# EAGLE design controlsu (EAGLE 5.12)
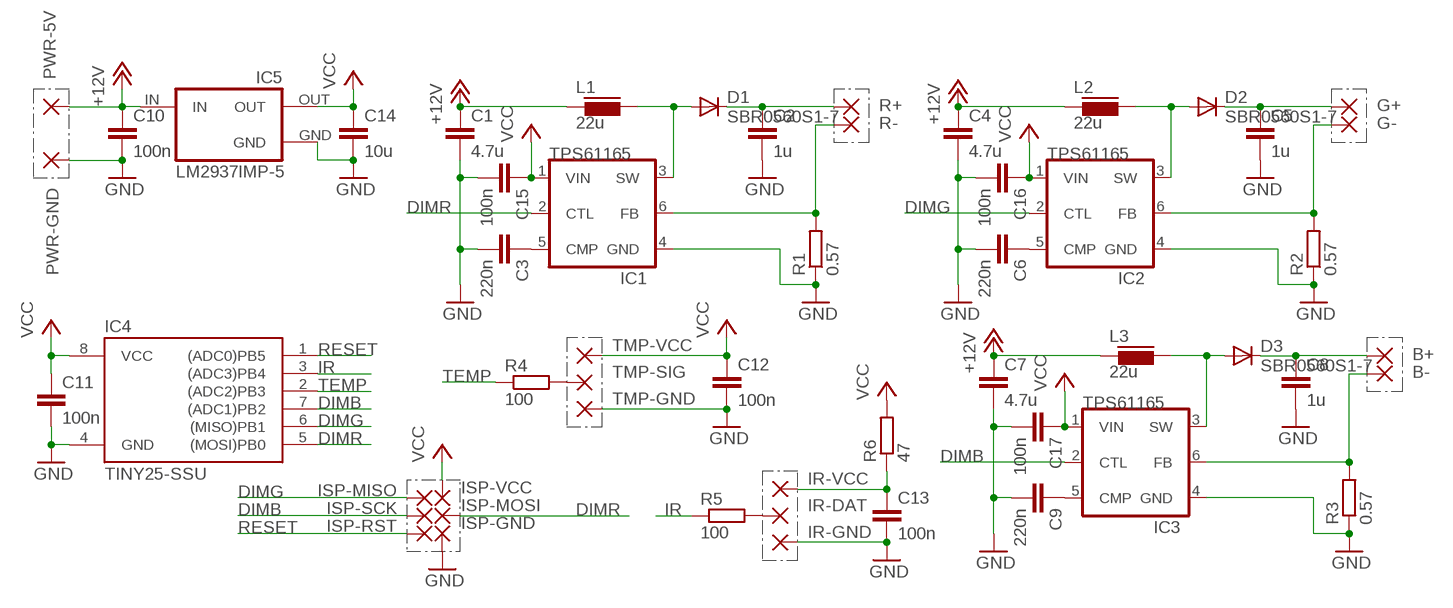
[diagram p0: schematic, sheet 1]

## Parts
B+  WIREPADSMD1,27-254  [SMD1,27-2,54]
B-  WIREPADSMD1,27-254  [SMD1,27-2,54]
C1  4.7u  C-EUC2012  [C2012]
C2  1u  C-EUC2012  [C2012]
C3  220n  C-EUC2012  [C2012]
C4  4.7u  C-EUC2012  [C2012]
C5  1u  C-EUC2012  [C2012]
C6  220n  C-EUC2012  [C2012]
C7  4.7u  C-EUC2012  [C2012]
C8  1u  C-EUC2012  [C2012]
C9  220n  C-EUC2012  [C2012]
C10  100n  C-EUC2012  [C2012]
C11  100n  C-EUC2012  [C2012]
C12  100n  C-EUC2012  [C2012]
C13  100n  C-EUC2012  [C2012]
C14  10u  C-EUC2012  [C2012]
C15  100n  C-EUC2012  [C2012]
C16  100n  C-EUC2012  [C2012]
C17  100n  C-EUC2012  [C2012]
D1  SBR0560S1-7  DIODE-SOD123  [SOD123]
D2  SBR0560S1-7  DIODE-SOD123  [SOD123]
D3  SBR0560S1-7  DIODE-SOD123  [SOD123]
G+  WIREPADSMD1,27-254  [SMD1,27-2,54]
G-  WIREPADSMD1,27-254  [SMD1,27-2,54]
IC1  TPS61165  [SOT23-6]
IC2  TPS61165  [SOT23-6]
IC3  TPS61165  [SOT23-6]
IC4  TINY25-SSU  TINY2/4/85/V-SU  [SOIC8]
IC5  LM2937IMP-5  LM2937IMP-3.3  [SOT223]
IR-DAT  WIREPADSMD1,27-254  [SMD1,27-2,54]
IR-GND  WIREPADSMD1,27-254  [SMD1,27-2,54]
IR-VCC  WIREPADSMD1,27-254  [SMD1,27-2,54]
ISP-GND  WIREPADSMD1,27-254  [SMD1,27-2,54]
ISP-MISO  WIREPADSMD1,27-254  [SMD1,27-2,54]
ISP-MOSI  WIREPADSMD1,27-254  [SMD1,27-2,54]
ISP-RST  WIREPADSMD1,27-254  [SMD1,27-2,54]
ISP-SCK  WIREPADSMD1,27-254  [SMD1,27-2,54]
ISP-VCC  WIREPADSMD1,27-254  [SMD1,27-2,54]
L1  22u  NR-SERIESNR(S)60  [NR60]
L2  22u  NR-SERIESNR(S)60  [NR60]
L3  22u  NR-SERIESNR(S)60  [NR60]
PWR-5V  WIREPADSMD1,27-254  [SMD1,27-2,54]
PWR-GND  WIREPADSMD1,27-254  [SMD1,27-2,54]
R1  0.57  R-EU_M2012  [M2012]
R2  0.57  R-EU_M2012  [M2012]
R3  0.57  R-EU_M2012  [M2012]
R4  100  R-EU_M2012  [M2012]
R5  100  R-EU_M2012  [M2012]
R6  47  R-EU_M2012  [M2012]
R+  WIREPADSMD1,27-254  [SMD1,27-2,54]
R-  WIREPADSMD1,27-254  [SMD1,27-2,54]
TMP-GND  WIREPADSMD1,27-254  [SMD1,27-2,54]
TMP-SIG  WIREPADSMD1,27-254  [SMD1,27-2,54]
TMP-VCC  WIREPADSMD1,27-254  [SMD1,27-2,54]

## Nets
+12V: C1.1 C4.1 C7.1 C10.1 IC5.IN L1.P$1 L2.P$1 L3.P$1 PWR-5V.1(P)
DIMB: IC3.2(CTL) IC4.7((ADC1)PB2) ISP-SCK.1(P)
DIMG: IC2.2(CTL) IC4.6((MISO)PB1) ISP-MISO.1(P)
DIMR: IC1.2(CTL) IC4.5((MOSI)PB0) ISP-MOSI.1(P)
GND: C1.2 C2.2 C3.2 C4.2 C5.2 C6.2 C7.2 C8.2 C9.2 C10.2 C11.2 C12.2 C13.2 C14.2 C15.2 C16.2 C17.2 IC1.4(GND) IC2.4(GND) IC3.4(GND) IC4.4(GND) IC5.GND IR-GND.1(P) ISP-GND.1(P) PWR-GND.1(P) R1.1 R2.1 R3.1 TMP-GND.1(P)
IR: IC4.3((ADC3)PB4) R5.1
L1: D1.A IC1.3(SW) L1.P$2
L2: D2.A IC2.3(SW) L2.P$2
L3: D3.A IC3.3(SW) L3.P$2
N$1: C5.1 D2.C G+.1(P)
N$2: C6.1 IC2.5(CMP)
N$3: G-.1(P) IC2.6(FB) R2.2
N$4: R4.2 TMP-SIG.1(P)
N$5: B+.1(P) C8.1 D3.C
N$6: C2.1 D1.C R+.1(P)
N$7: IR-DAT.1(P) R5.2
N$8: C9.1 IC3.5(CMP)
N$9: C3.1 IC1.5(CMP)
N$10: IC1.6(FB) R1.2 R-.1(P)
N$11: B-.1(P) IC3.6(FB) R3.2
N$12: C13.1 IR-VCC.1(P) R6.1
RESET: IC4.1((ADC0)PB5) ISP-RST.1(P)
TEMP: IC4.2((ADC2)PB3) R4.1
VCC: C11.1 C12.1 C14.1 C15.1 C16.1 C17.1 IC1.1(VIN) IC2.1(VIN) IC3.1(VIN) IC4.8(VCC) IC5.OUT ISP-VCC.1(P) R6.2 TMP-VCC.1(P)

## Power pins joined to a net without a drawn wire
GND: IC5.GND@(GND)

## Library data of the parts
B+ B- G+ G- IR-DAT IR-GND IR-VCC ISP-GND ISP-MISO ISP-MOSI ISP-RST ISP-SCK ISP-VCC PWR-5V PWR-GND R+ R- TMP-GND TMP-SIG TMP-VCC = wirepad:WIREPAD: Wire PAD connect wire on PCB
C1-C17 = rcl:C-EU: CAPACITOR, European symbol
D1-D3 = diode:DIODE-: DIODE
IC1-IC3 = vreg-switch:TPS61165: High Brightness White LED Driver in 2mm x 2mm QFN and SOT-23 Packages FEATURES 3-V to 18-V Input Voltage Range 38-V Open LED Protection 200-mV Reference Voltage With 2% Accuracy 1.2-A Switch FET With 1.2-MHz Switching Frequency Flexible 1 Wire Digital and PWM Brightness Control Built-in Soft Start Up to 90% Efficiency 2mm × 2mm × 0.8mm 6-pin QFN Package With Thermal Pad, and SOT-23 Package APPLICATIONS High Brightness LED Lighting White LED Backlighting for Media Form Factor Display
IC4 = avr-1:TINY2/4/85/V: 8-bit AVR Microcontroller with 2/4/8K Bytes In-System Programmable Flash 2/4/8K Bytes Flash 128/256/512 Bytes EEPROM 128/256/512 Bytes SRAM
IC5 = lm2937:LM2937IMP-*: 400 and 500 mA Low Dropout Voltage Regulator NATIONAL SEMICONDUCTOR created by Peter.Hofmann@ph-tronic.de <mailto:Reter.Hofmann@ph-tronic.de> 10-2004 Rev.0
L1-L3 = inductor:NR-SERIES
R1-R6 = rcl:R-EU_: RESISTOR, European symbol

## Board
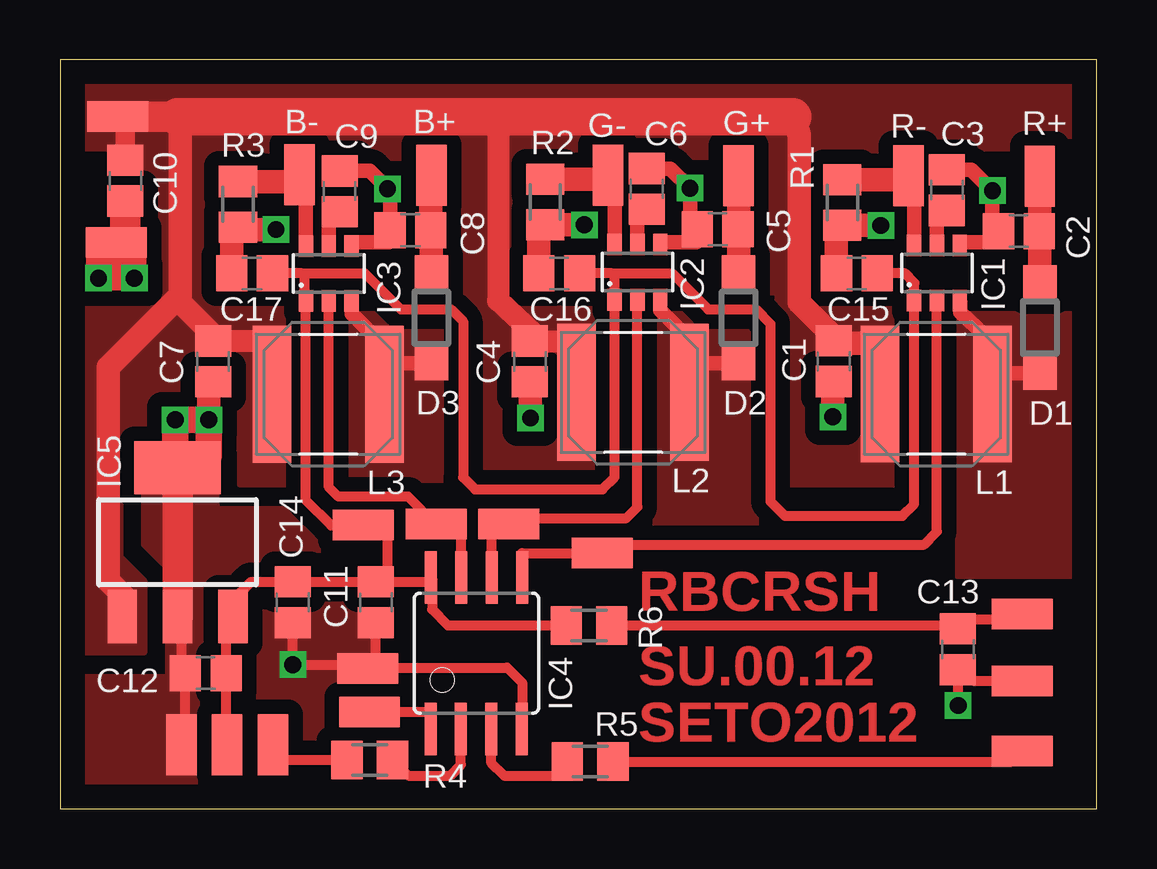
[diagram p1: board, top side]
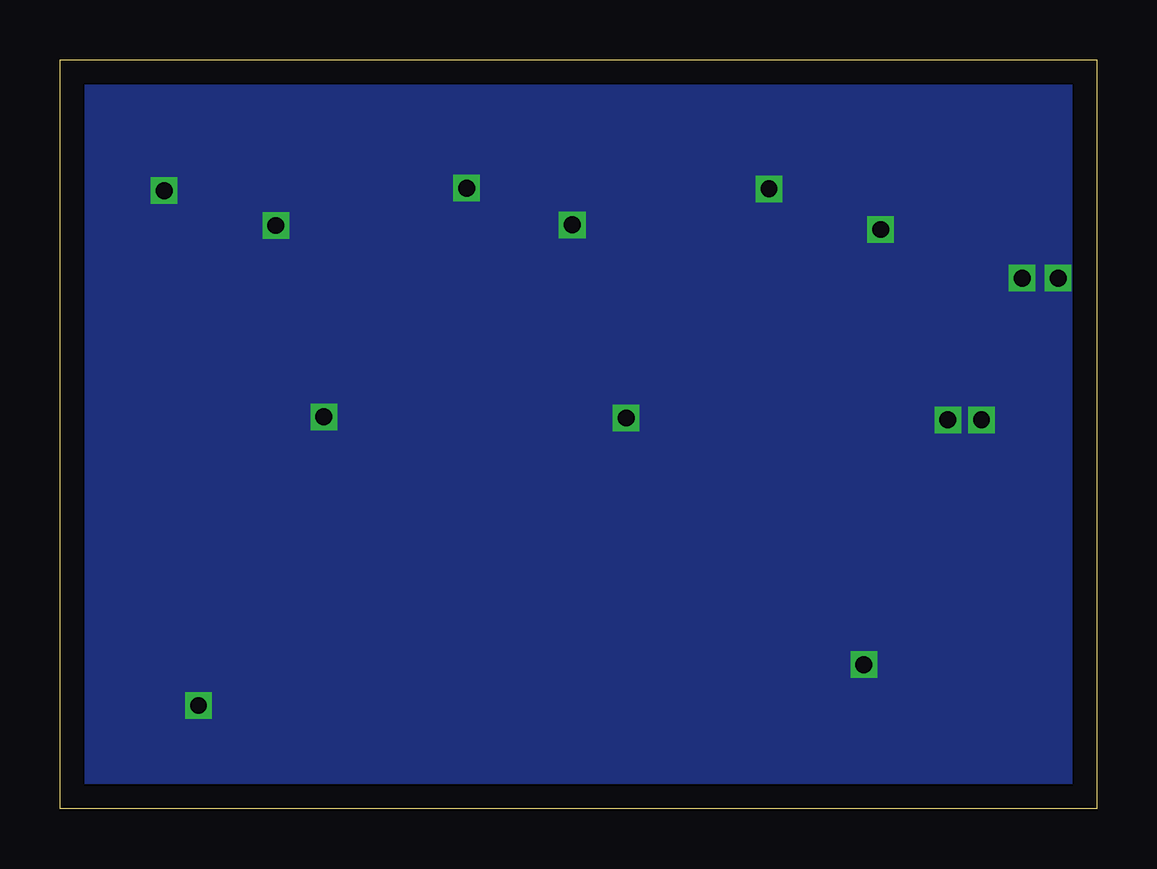
[diagram p2: board, bottom side, seen from below]

Size 43.19 x 31.19 mm. Coordinates in mm from the lower left corner, seen from the top.
Outline: 0,0 43.19,0 43.19,31.19 0,31.19 0,0
Copper layers (1*16): Top 0.035mm / dielectric 1.5mm / Bottom 0.035mm
Design rules "default": minimum track width 10mil, minimum drill 24mil, track to track 8mil, track to pad 8mil, pad to pad 8mil, via to via 8mil, smd to smd 8mil, copper to edge 40mil, drill to drill 8mil, minimum pad ring 10mil, minimum via ring 8mil, stop-mask expansion 4mil, vias tented up to drill 0mil, thermal gap 10mil

### Footprints (pad centres in the part's own frame; a part is rotated, then mirrored left to right if it is on the bottom)
SMD1,27-2,54 = smd 1.27 x 2.54: 1 0,0
C2012 = smd 1.3 x 1.5: 1 -0.85,0; 2 0.85,0
SOD123 = smd 1.4 x 1.4: A 1.9,0; C -1.9,0
SOT23-6 = smd 0.6 x 0.9: 1 -0.95,-1.15; 2 0,-1.15; 3 0.95,-1.15; 4 0.95,1.15; 5 0,1.15; 6 -0.95,1.15
SOIC8 = smd 0.5 x 2.2: 1 -1.905,-3.154; 2 -0.645,-3.154; 3 0.625,-3.154; 4 1.895,-3.154; 5 1.905,3.154; 6 0.635,3.154; 7 -0.635,3.154; 8 -1.905,3.154
SOT223 = smd 1.219 x 2.235: GND 0,-3.099; IN -2.311,-3.099; OUT 2.311,-3.099 | smd 3.6 x 2.2: GND@ 0,3.099
NR60 = smd 1.6 x 5.7: P$1 -2.35,0; P$2 2.35,0
M2012 = smd 1.3 x 1.6: 1 -0.95,0; 2 0.95,0

### Placement (x,y rotation side)
B+  15.48,26.4 0 top
B-  9.97,26.4 180 top
C1  32.24,18.64 270 top
C2  39.95,24.06 180 top
C3  36.96,25.77 90 top
C4  19.58,18.63 270 top
C5  27.4,24.14 180 top
C6  24.45,25.82 90 top
C7  6.38,18.63 270 top
C8  14.6,24.1 180 top
C9  11.65,25.72 90 top
C10  2.73,26.16 270 top
C11  13.16,8.6 270 top
C12  6.07,5.65 180 top
C13  37.41,6.64 270 top
C14  9.7,8.6 270 top
C15  33.2,22.3 180 top
C16  20.8,22.3 180 top
C17  8,22.3 180 top
D1  40.83,20.05 270 top
D2  28.28,20.45 270 top
D3  15.47,20.45 270 top
G+  28.28,26.38 0 top
G-  22.83,26.4 0 top
IC1  36.54,22.31 0 top
IC2  24.06,22.35 0 top
IC3  11.2,22.3 0 top
IC4  17.35,6.47 0 top
IC5  4.9,11.1 0 top
IR-DAT  40.09,2.4 90 top
IR-GND  40.09,5.32 90 top
IR-VCC  40.09,8.11 90 top
ISP-GND  12.83,5.84 90 top
ISP-MISO  18.69,11.86 90 top
ISP-MOSI  22.6,10.64 90 top
ISP-RST  12.9,4.03 90 top
ISP-SCK  15.68,11.86 90 top
ISP-VCC  12.63,11.82 90 top
L1  36.51,17.27 0 top
L2  23.88,17.35 0 top
L3  11.18,17.27 0 top
PWR-5V  2.4,28.84 270 top
PWR-GND  2.35,23.59 270 top
R1  32.59,25.26 90 top
R2  20.22,25.28 90 top
R3  7.42,25.18 90 top
R4  12.91,2.03 180 top
R5  22.09,1.96 0 top
R6  22.04,7.64 180 top
R+  40.82,26.35 180 top
R-  35.35,26.37 0 top
TMP-GND  5.06,2.67 0 top
TMP-SIG  8.87,2.67 0 top
TMP-VCC  6.96,2.67 0 top

### Tracks (layer width: path | path; a pad name or v marks a point on that pad's centre or on a via)
+12V
  Top 0.61: L1.P$1 34.16,19.4 34.16,19.49 | 21.53,19.48 L2.P$1 | L3.P$1 8.82,19.48 | 5,28.74 4.9,28.84
  Top 0.813: C10.1 2.73,28.84 PWR-5V.1
  Top 0.912: 21.53,19.48 C4.1 19.68,19.84 18.25,21.18 18.25,28.84 | 8.82,19.48 C7.1 6.38,19.72 5,21.1
  Top 0.975: IC5.IN 2.59,8.91 2,9.5 2,18.4 5,21.4 5,28.74 | 30.54,28.84 30.8,28.07 30.8,21.1 32.24,19.66 C1.1 32.34,19.4 34.16,19.4
  Top 1.27: 5,28.84 2.73,28.84
  Top 1.56: 30.54,28.84 18.25,28.84 5,28.84 4.9,28.84
  pour Top (isolate 0.61, no thermals): 0,31 43,31 43,27.5 36.5,27.5 36.5,13.5 29.9,13.5 29.9,21.5 22.9,21.5 22.9,13.5 17,13.5 17,21.5 10,21.5 9.5,13.5 7.5,13.5 7.5,15 2.5,15 2.5,10.5 3.5,9.5 3.5,6.5 0,6.5 0,21 2.5,21 2.5,27.5 0,27.5
DIMB
  Top 0.406: IC4.7 16.72,11.86 ISP-SCK.1 15.64,11.86 14.5,13 11.6,13 11.2,13.4 IC3.2
DIMG
  Top 0.406: IC4.6 17.99,11.86 ISP-MISO.1 | ISP-MISO.1 19,11.88 | IC2.2 24.06,12.56 23.6,12.1 19.43,12.1 ISP-MISO.1
DIMR
  Top 0.406: IC1.2 36.54,11.54 36,11 23.5,11 23.34,10.34 ISP-MOSI.1 19.26,10.64 IC4.5
GND  (via drill 0.7)
  Top 0.406: TMP-GND.1 5.22,2.67 C12.2 | C12.2 5.25,5.65 | ISP-GND.1 13,5.88 18.62,5.88 19.25,5.25 IC4.4 | C11.2 13.16,6.17 ISP-GND.1 | C13.2 38.08,5.32 IR-GND.1 | ISP-GND.1 12.87,6 v9.7,6 C14.2 | C13.2 37.4,6 | C12.2 5.06,5.49 5.06,7.84 IC5.GND | v37.42,4.3 37.42,5.7 C13.2
  Top 0.61: C4.2 19.6,17.61 | C7.2 6.2,17.73 | C9.2 12.91,26.57 v13.65,25.82 13.75,25.72 C8.2 13.75,23.65 13.7,23.6 12.3,23.6 IC3.4 | C6.2 25.43,26.67 v26.25,25.85 26.25,24.25 C5.2 26.5,24.14 26.5,23.6 25.01,23.6 IC2.4 | C3.2 37.98,26.62 v38.85,25.75 38.85,24.11 C2.2 38.8,24.06 38.8,23.6 37.49,23.6 IC1.4
  Top 0.975: 6.2,17.73 6.4,17.76 C7.2 6.2,17.78 v6.2,16.2 | v19.6,16.27 19.6,17.86 C4.2 | v32.2,16.32 32.2,17.75 C1.2 | R3.1 7.2,24.23 | C17.2 7.15,24.23 R3.1 | v9,24.13 7.42,24.13 R3.1 | v21.85,24.33 R2.1 19.95,24.33 C16.2 | v34.2,24.3 32.79,24.31 R1.1 32.35,24.31 C15.2 | 4.8,14.7 6.2,14.7 6.2,14.2
  Top 1.016: IC5.GND@ 6.2,14.2 | PWR-GND.1 1.6,23.59 v1.6,22.1 2.3,22.1 | 2.73,23.59 3.1,23.59 v3.1,22.1 2.3,22.1 | 2.3,22.1 2.3,23.6 2.4,23.6
  Top 1.1: 4.8,14.7 v4.8,16.2 v6.2,16.2 6.2,14.7
  Top 1.27: 2.71,23.6 2.73,23.59 C10.2 | IC5.GND IC5.GND@
  pour Bottom (no thermals): 0.1,30.7 42.7,30.7 42.7,-0.1 0.1,-0.1
  pour Top (isolate 0.61, no thermals): 4.5,5.5 4.5,10 3.5,11 3.5,13.5 6.5,13.5 6.5,12.5 13,12.5 13,0 0,0 0,5.5
IR
  Top 0.406: IC4.3 17.98,1.9 18.5,1.38 20.56,1.38 R5.1
L1
  Top 0.61: L1.P$2 38.86,18.5 | 38.86,18.5 38.86,19.41 37.5,20.68 37.5,21.05 IC1.3 | 39.1,16.65 38.86,16.89 | D1.A 38.91,18.15 38.86,18.5
  pour Top (isolate 0.61, no thermals): 37.4,20.6 37.4,9.7 42.1,9.7 42.1,20.6
L2
  Top 0.61: IC2.3 25.01,20.77 26.2,19.57 26.2,18.55 | 26.2,18.55 26.2,17.12 L2.P$2 26.3,17.03 | 26.2,18.55 D2.A
  pour Top (isolate 0.61, no thermals): 24.8,20.6 24.8,11.7 29,11.7 29,20.6
L3
  Top 0.61: 13.53,16.65 L3.P$2 13.5,17.05 13.5,18.7 | IC3.3 12.15,20.63 13.5,19.27 13.5,18.7 | D3.A 13.65,18.55 13.5,18.7
  pour Top (isolate 0.61, no thermals): 11.9,20.6 11.9,13.7 16.1,13.7 16.1,20.6
N$1
  Top 0.61: C5.1 28.28,24.04
  Top 0.975: 28.28,24.04 G+.1 | D2.C 28.28,24.04
N$2
  Top 0.61: IC2.5 24.06,25.04 C6.1
N$3
  Top 0.61: IC2.6 23.11,26.5 G-.1
  Top 0.975: R2.2 22.63,26.23 G-.1
N$4
  Top 0.406: R4.2 8.87,2.03 TMP-SIG.1
N$5
  Top 0.61: 15.45,26.38 B+.1 | 15.47,24.08 C8.1
  Top 0.975: C8.1 15.45,26.38 | D3.C 15.47,24.08
N$6
  Top 0.61: 40.82,24.06 C2.1 | D1.C 40.82,22.25
  Top 0.975: R+.1 40.82,24.06 40.82,22.25
N$7
  Top 0.406: R5.2 39.65,1.96 IR-DAT.1
N$8
  Top 0.61: IC3.5 11.2,24.83 C9.1
N$9
  Top 0.61: IC1.5 36.54,24.92 C3.1
N$10
  Top 0.61: IC1.6 35.59,26.42 R-.1
  Top 0.975: R1.2 35.3,26.21 R-.1
N$11
  Top 0.61: IC3.6 10.25,26.36 B-.1
  Top 0.975: R3.2 9.87,26.13 B-.1
N$12
  Top 0.406: R6.1 37.27,7.64 C13.1 37.4,7.9 40.09,7.9 IR-VCC.1
RESET
  Top 0.406: ISP-RST.1 15.45,4.03 IC4.1
TEMP
  Top 0.406: IC4.2 16.71,1.83 16.25,1.38 14.51,1.38 R4.1
VCC
  Top 0.406: R6.2 16.16,7.64 15.5,8.3 15.5,9.58 IC4.8 15.45,9.45 13.66,9.45 | TMP-VCC.1 6.92,2.67 C12.1 6.92,7.71 IC5.OUT 7.5,8.29 7.5,9 7.95,9.45 C14.1 C11.1 13.66,9.45 | R6.2 20.7,7.64 | 13.66,9.45 13.66,11.82 ISP-VCC.1 12.81,11.8 11.3,11.8 10.25,12.85 IC3.1 10.2,21.19 10.2,22.2 10.1,22.3 | R6.2 20.7,8.03 | 10.1,22.3 C17.1 | 10.1,22.3 12.7,22.3 14.2,20.8 16.3,20.8 16.8,20.3 16.8,13.8 17.3,13.3 22.6,13.3 23.11,13.81 IC2.1 23.11,22.19 23,22.3 | 23,22.3 C16.1 | 23,22.3 25.5,22.3 27,20.8 29,20.8 29.6,20.2 29.6,12.8 30.2,12.2 35.1,12.2 35.59,12.69 IC1.1 35.6,21.18 35.6,21.9 35.2,22.3 C15.1

### Text on the board
Top: RBCRSH | SU.00.12 | SETO2012